# EAGLE design board (EAGLE 9.2.2)
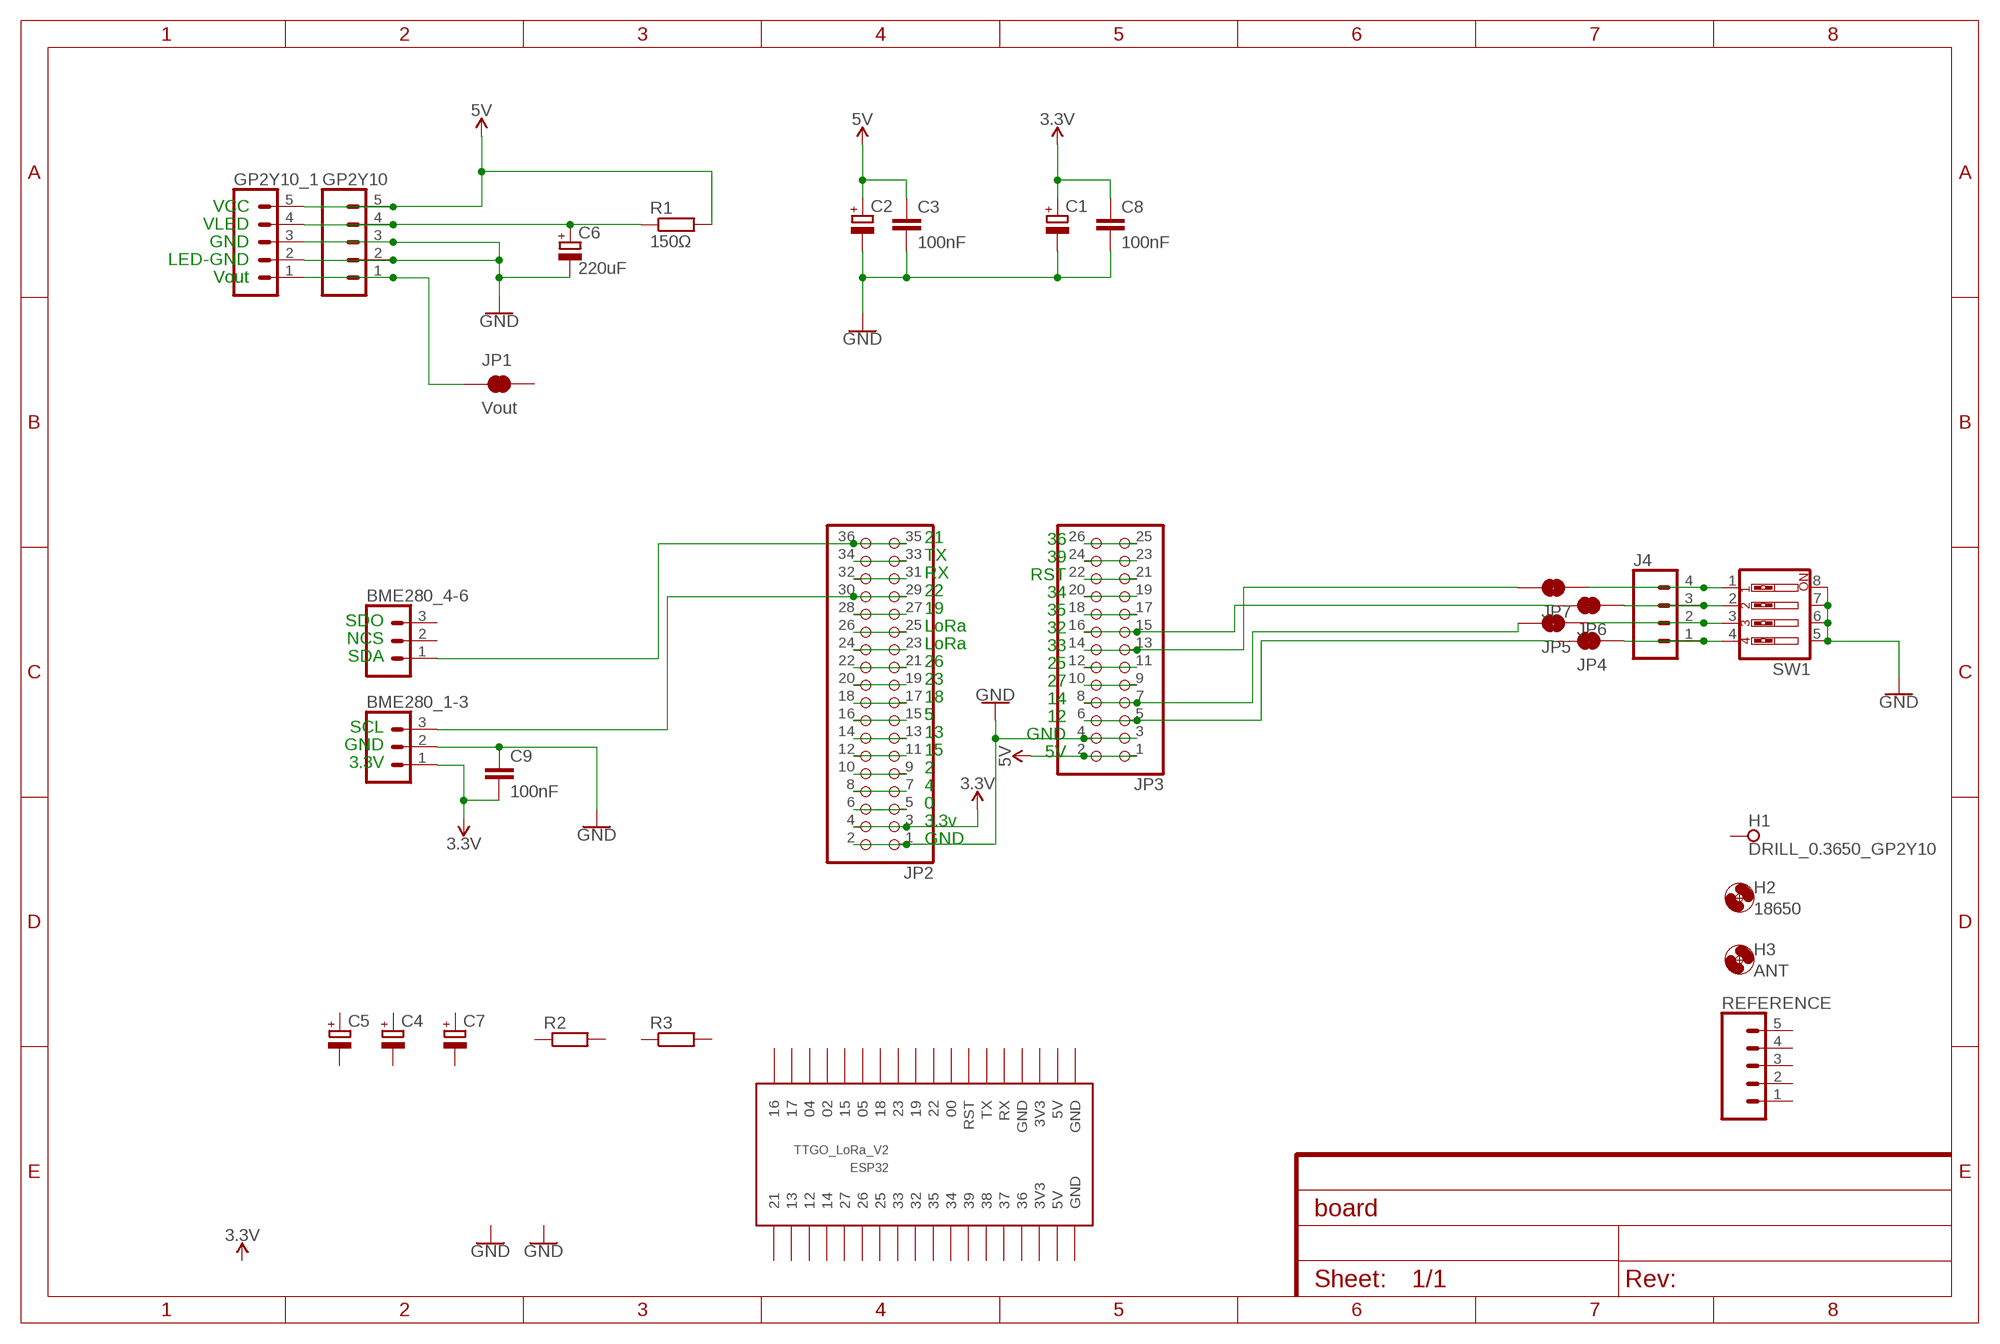
[diagram p0: schematic, sheet 1]

## Parts
BME280_1-3  CONN_03  [1X03]
BME280_4-6  CONN_03  [1X03]
C1  CPOL-EUD  [PANASONIC_D]
C2  CPOL-EUD  [PANASONIC_D]
C3  100nF  C-EUC0805  [C0805]
C4  CPOL-EUD  [PANASONIC_D]
C5  CPOL-EUD  [PANASONIC_D]
C6  220uF  CPOL-EUE2.5-5  [E2,5-5]
C7  CPOL-EUE2.5-5  [E2,5-5]
C8  100nF  C-EUC0805  [C0805]
C9  100nF  C-EUC0805  [C0805]
ESP32  TTGO_LoRa_V2  WIFI-LORA-32  [2.54MM_2X18]
GP2Y10  CONN_05  [1X05]
GP2Y10_1  CONN_05  [1X05]
H1  DRILL_0.3650_GP2Y10  SPECIAL_DRILL_0.3650  [PAD_0.3650]
H2  18650  MOUNT-HOLE2.8  [2,8]
H3  ANT  MOUNT-HOLE3.0  [3,0]
J4  CONN_04LOCK  [1X04_LOCK]
JP1  Vout  JUMPER-SMT_2_NC_TRACE_SILK  [SMT-JUMPER_2_NC_TRACE_SILK]
JP2  PINHD-2X18  [2X18]
JP3  PINHD-2X13  [2X13]
JP4  JUMPER-SMT_2_NC_TRACE_SILK  [SMT-JUMPER_2_NC_TRACE_SILK]
JP5  JUMPER-SMT_2_NC_TRACE_SILK  [SMT-JUMPER_2_NC_TRACE_SILK]
JP6  JUMPER-SMT_2_NC_TRACE_SILK  [SMT-JUMPER_2_NC_TRACE_SILK]
JP7  JUMPER-SMT_2_NC_TRACE_SILK  [SMT-JUMPER_2_NC_TRACE_SILK]
R1  150Ω  R-EU_0204/7  [0204/7]
R2  R-EU_0204/7  [0204/7]
R3  R-EU_0204/7  [0204/7]
REFERENCE  CONN_05  [1X05]
SW1  SW_DIP-4  [EDG-04]

## Nets
3.3V [power]: BME280_1-3.1 C1.+ C8.1 C9.2 JP2.3 JP2.4
5V [power]: C2.+ C3.1 GP2Y10.5 GP2Y10_1.5 JP3.1 JP3.2 R1.2
GND [power]: BME280_1-3.2 C1.- C2.- C3.2 C6.- C8.2 C9.1 GP2Y10.2 GP2Y10.3 GP2Y10_1.2 GP2Y10_1.3 JP2.1 JP2.2 JP3.3 JP3.4 SW1.5 SW1.6 SW1.7 SW1.8
N$1: GP2Y10.1 GP2Y10_1.1 JP1.1
N$2 [power]: C6.+ GP2Y10.4 GP2Y10_1.4 R1.1
N$3: BME280_4-6.1 JP2.35 JP2.36
N$4: JP2.33 JP2.34
N$5: JP2.31 JP2.32
N$6: BME280_1-3.3 JP2.29 JP2.30
N$7: JP2.27 JP2.28
N$8: JP2.25 JP2.26
N$9: JP3.25 JP3.26
N$10: JP3.23 JP3.24
N$11: JP3.21 JP3.22
N$12: JP3.17 JP3.18
N$14: JP3.15 JP3.16 JP6.2
N$15: JP3.13 JP3.14 JP7.2
N$16: JP3.11 JP3.12
N$17: JP3.9 JP3.10
N$18: JP3.7 JP3.8 JP5.2
N$19: JP3.5 JP3.6 JP4.2
N$20: JP3.19 JP3.20
N$24: JP2.5 JP2.6
N$25: JP2.7 JP2.8
N$26: JP2.9 JP2.10
N$27: JP2.11 JP2.12
N$28: JP2.13 JP2.14
N$29: JP2.15 JP2.16
N$30: JP2.17 JP2.18
N$31: JP2.19 JP2.20
N$32: JP2.21 JP2.22
N$33: JP2.23 JP2.24
N$39 [power]: J4.1 JP4.1 SW1.4
N$40 [power]: J4.2 JP5.1 SW1.3
N$41 [power]: J4.3 JP6.1 SW1.2
N$42 [power]: J4.4 JP7.1 SW1.1
Unconnected: BME280_4-6.2 BME280_4-6.3 C4.+ C4.- C5.+ C5.- C7.+ C7.- ESP32.P$1(GND) ESP32.P$2(5V) ESP32.P$3(3V3) ESP32.P$4(GND) ESP32.P$5(RX) ESP32.P$6(TX) ESP32.P$7(RST) ESP32.P$8 ESP32.P$9 ESP32.P$10 ESP32.P$11 ESP32.P$12 ESP32.P$13 ESP32.P$14 ESP32.P$15 ESP32.P$16 ESP32.P$17 ESP32.P$18 ESP32.P$19 ESP32.P$20 ESP32.P$21 ESP32.P$22 ESP32.P$23 ESP32.P$24 ESP32.P$25 ESP32.P$26 ESP32.P$27 ESP32.P$28 ESP32.P$29 ESP32.P$30 ESP32.P$31 ESP32.P$32 ESP32.P$33 ESP32.P$34(3V3) ESP32.P$35(5V) ESP32.P$36(GND) H1.1 JP1.2 R2.1 R2.2 R3.1 R3.2 REFERENCE.1 REFERENCE.2 REFERENCE.3 REFERENCE.4 REFERENCE.5

## Notes on the sheet
- VCC
- VLED
- GND
- LED-GND
- Vout
- 36
- 21
- 39
- TX
- RST
- RX
- 34
- 22
- 35
- SDO | 19
- 32
- NCS | LoRa
- 33
- SDA | LoRa
- 25
- 26
- 27
- 23
- 14
- 18
- 12
- SCL | 5
- GND
- GND | 13
- 5V
- 3.3V | 15
- 2
- 4
- 0
- 3.3v
- GND

## Library data of the parts
BME280_1-3 BME280_4-6 = SparkFun-Connectors:CONN_03: Multi connection point. Often used as Generic Header-pin footprint for 0.1 inch spaced/style header connections On any of the 0.1 inch spaced packages, you can populate with these: Break Away Headers - Straight <https://www.sparkfun.com/products/116> (PRT-00116) Break Away Male Headers - Right Angle <https://www.sparkfun.com/products/553> (PRT-00553) Female Headers <https://www.sparkfun.com/products/115> (PRT-00115) Break Away Headers - Machine Pin <https://www.sparkfun.com/products/117> (PRT-00117) Break Away Female Headers - Swiss Machine Pin <https://www.sparkfun.com/products/743> (PRT-00743) Stackable Header - 3 Pin (Female, 0.1") <https://www.sparkfun.com/products/13875> (PRT-13875) For SCREWTERMINALS and SPRING TERMINALS visit here: Screw Terimnals on SparkFun.com <https://www.sparkfun.com/search/results?term=Screw+Terminals> (5mm/3.5mm/2.54mm spacing) This device is also useful as a general connection point to wire up your design to another part of your project. Our various solder wires solder well into these plated through hole pads. Hook-Up Wire - Assortment (Stranded, 22 AWG) <https://www.sparkfun.com/products/11375> (PRT-11375) Hook-Up Wire - Assortment (Solid Core, 22 AWG) <https://www.sparkfun.com/products/11367> (PRT-11367) View the entire wire category on our website here <https://www.sparkfun.com/categories/141> Special notes: Molex polarized connector foot print use with SKU : PRT-08232 with associated crimp pins and housings.
C1 C2 C4-C7 = rcl:CPOL-EU: POLARIZED CAPACITOR, European symbol; SPICEPREFIX: C
C3 C8 C9 = rcl:C-EU: CAPACITOR, European symbol; SPICEPREFIX: C
ESP32 = ESP32_modules:WIFI-LORA-32
GP2Y10 GP2Y10_1 REFERENCE = SparkFun-Connectors:CONN_05: Multi connection point. Often used as Generic Header-pin footprint for 0.1 inch spaced/style header connections On any of the 0.1 inch spaced packages, you can populate with these: Break Away Headers - Straight <https://www.sparkfun.com/products/116> (PRT-00116) Break Away Male Headers - Right Angle <https://www.sparkfun.com/products/553> (PRT-00553) Female Headers <https://www.sparkfun.com/products/115> (PRT-00115) Break Away Headers - Machine Pin <https://www.sparkfun.com/products/117> (PRT-00117) Break Away Female Headers - Swiss Machine Pin <https://www.sparkfun.com/products/743> (PRT-00743) For SCREWTERMINALS and SPRING TERMINALS visit here: Screw Terimnals on SparkFun.com <https://www.sparkfun.com/search/results?term=Screw+Terminals> (5mm/3.5mm/2.54mm spacing) This device is also useful as a general connection point to wire up your design to another part of your project. Our various solder wires solder well into these plated through hole pads. Hook-Up Wire - Assortment (Stranded, 22 AWG) <https://www.sparkfun.com/products/11375> (PRT-11375) Hook-Up Wire - Assortment (Solid Core, 22 AWG) <https://www.sparkfun.com/products/11367> (PRT-11367) View the entire wire category on our website here <https://www.sparkfun.com/categories/141> Special notes: Molex polarized connector foot print use with SKU : PRT-08231 with associated crimp pins and housings. 1MM SMD Version SKU: PRT-10208
H1 = special-drill:SPECIAL_DRILL_: Special drills
H2 H3 = holes:MOUNT-HOLE: MOUNTING HOLE with drill center marker
J4 = SparkFun-Connectors:CONN_04: Multi connection point. Often used as Generic Header-pin footprint for 0.1 inch spaced/style header connections On any of the 0.1 inch spaced packages, you can populate with these: Break Away Headers - Straight <https://www.sparkfun.com/products/116> (PRT-00116) Break Away Male Headers - Right Angle <https://www.sparkfun.com/products/553> (PRT-00553) Female Headers <https://www.sparkfun.com/products/115> (PRT-00115) Break Away Headers - Machine Pin <https://www.sparkfun.com/products/117> (PRT-00117) Break Away Female Headers - Swiss Machine Pin <https://www.sparkfun.com/products/743> (PRT-00743) For SCREWTERMINALS and SPRING TERMINALS visit here: Screw Terimnals on SparkFun.com <https://www.sparkfun.com/search/results?term=Screw+Terminals> (5mm/3.5mm/2.54mm spacing) This device is also useful as a general connection point to wire up your design to another part of your project. Our various solder wires solder well into these plated through hole pads. Hook-Up Wire - Assortment (Stranded, 22 AWG) <https://www.sparkfun.com/products/11375> (PRT-11375) Hook-Up Wire - Assortment (Solid Core, 22 AWG) <https://www.sparkfun.com/products/11367> (PRT-11367) View the entire wire category on our website here <https://www.sparkfun.com/categories/141> Special notes: Molex polarized connector foot print use with SKU : PRT-08231 with associated crimp pins and housings. 1MM SMD Version SKU: PRT-10208; PROD_ID: CONN-09696
JP1 JP4-JP7 = SparkFun-Jumpers:JUMPER-SMT_2_NC_TRACE: Normally closed trace jumper This jumper has a trace between two pads so it's normally closed (NC). Use a razor knife to open the connection. For best results follow the IPC guidelines for cutting traces: Cutout at least 0.063 mm (0.005 in). Remove all loose material to clean up the cut area. Seal the cut with an approved epoxy. Reapply solder to reclose the connection.
JP2 = pinhead:PINHD-2X18: PIN HEADER
JP3 = pinhead:PINHD-2X13: PIN HEADER
R1-R3 = rcl:R-EU_: RESISTOR, European symbol; SPICEPREFIX: R
SW1 = special:SW_DIP-4: DIP SWITCH

## Net classes
0 default: width 0.254 mm, clearance 0.205 mm
1 power: width 0.914 mm, clearance 0.254 mm

## Board
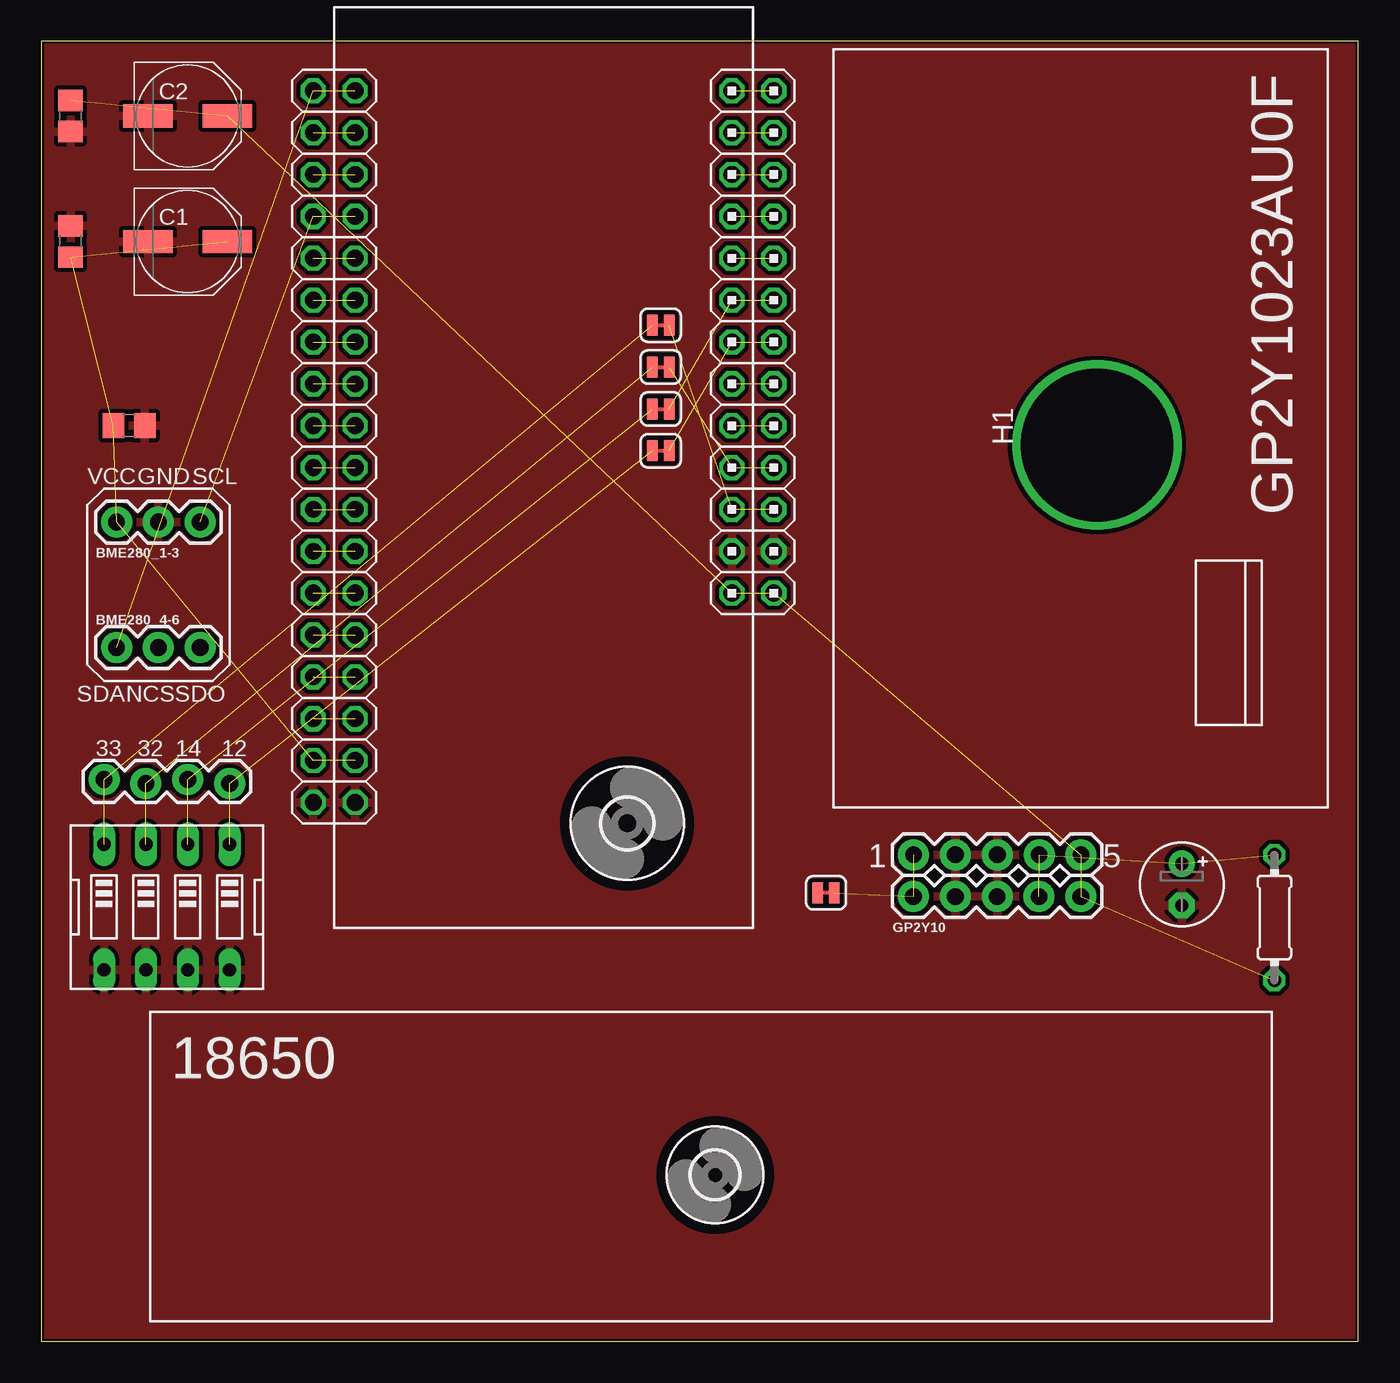
[diagram p1: board, top side]
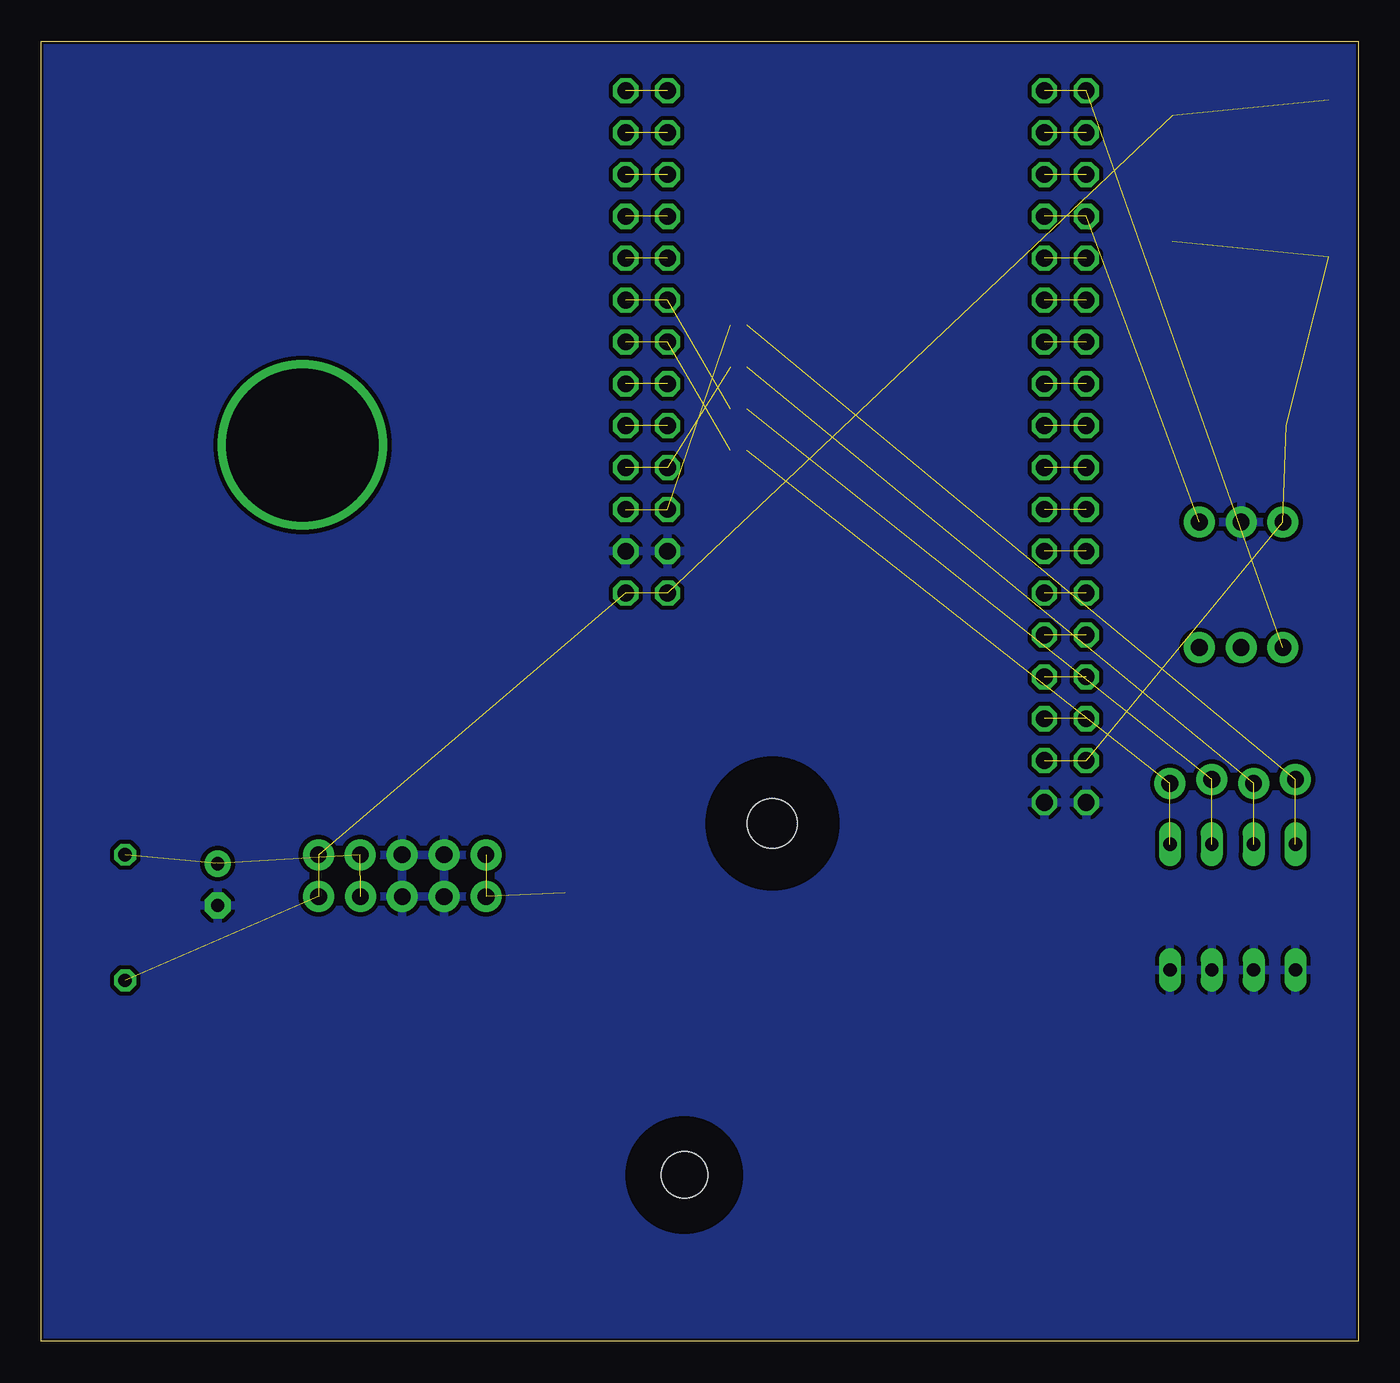
[diagram p2: board, bottom side, seen from below]

Size 79.92 x 78.89 mm. Coordinates in mm from the lower left corner, seen from the top.
Outline: 0,0 79.92,0 79.92,78.89 0,78.89 0,0
Copper layers (1*16): Top 0.035mm / dielectric 1.5mm / Bottom 0.035mm
Design rules "default *": minimum track width 6mil, minimum drill 0.35mm, track to track 6mil, track to pad 6mil, pad to pad 6mil, via to via 6mil, smd to smd 6mil, copper to edge 6mil, drill to drill 6mil, minimum pad ring 10mil, minimum via ring 8mil, stop-mask expansion 4mil, vias tented up to drill 0mil, thermal gap 10mil

### Footprints (pad centres in the part's own frame; a part is rotated, then mirrored left to right if it is on the bottom)
1X03 = drill 1.016 pad 1.88: 1 0,0; 2 2.54,0; 3 5.08,0
PANASONIC_D = smd 3 x 1.4: + 2.4,0; - -2.4,0
C0805 = smd 1.3 x 1.5: 1 -0.95,0; 2 0.95,0
E2,5-5 = drill 0.813 pad 1.6: + -1.27,0 | drill 0.813 pad 1.6 octagon: - 1.27,0
2.54MM_2X18 = drill 0.8 square: P$1 -20.32,-11.43; P$36 -20.32,11.43 | drill 0.8 octagon: P$2 -17.78,-11.43; P$3 -15.24,-11.43; P$4 -12.7,-11.43; P$5 -10.16,-11.43; P$6 -7.62,-11.43; P$7 -5.08,-11.43; P$8 -2.54,-11.43; P$9 0,-11.43; P$10 2.54,-11.43; P$11 5.08,-11.43; P$12 7.62,-11.43; P$13 10.16,-11.43; P$14 12.7,-11.43; P$15 15.24,-11.43; P$16 17.78,-11.43; P$17 20.32,-11.43; P$18 22.86,-11.43; P$19 22.86,11.43; P$20 20.32,11.43; P$21 17.78,11.43; P$22 15.24,11.43; P$23 12.7,11.43; P$24 10.16,11.43; P$25 7.62,11.43; P$26 5.08,11.43; P$27 2.54,11.43; P$28 0,11.43; P$29 -2.54,11.43; P$30 -5.08,11.43; P$31 -7.62,11.43; P$32 -10.16,11.43; P$33 -12.7,11.43; P$34 -15.24,11.43; P$35 -17.78,11.43
1X05 = drill 1.016 pad 1.88: 1 0,0; 2 2.54,0; 3 5.08,0; 4 7.62,0; 5 10.16,0
PAD_0.3650 = drill 9.271 pad 9.271: 1 0,0
2,8 = hole 2.8: 0,0
3,0 = hole 3: 0,0
1X04_LOCK = drill 1.016 pad 1.88: 1 0,0.127; 2 2.54,-0.127; 3 5.08,0.127; 4 7.62,-0.127
SMT-JUMPER_2_NC_TRACE_SILK = smd 0.635 x 1.27: 1 -0.508,0; 2 0.508,0
2X18 = drill 1.016 octagon: 1 -21.59,-1.27; 2 -21.59,1.27; 3 -19.05,-1.27; 4 -19.05,1.27; 5 -16.51,-1.27; 6 -16.51,1.27; 7 -13.97,-1.27; 8 -13.97,1.27; 9 -11.43,-1.27; 10 -11.43,1.27; 11 -8.89,-1.27; 12 -8.89,1.27; 13 -6.35,-1.27; 14 -6.35,1.27; 15 -3.81,-1.27; 16 -3.81,1.27; 17 -1.27,-1.27; 18 -1.27,1.27; 19 1.27,-1.27; 20 1.27,1.27; 21 3.81,-1.27; 22 3.81,1.27; 23 6.35,-1.27; 24 6.35,1.27; 25 8.89,-1.27; 26 8.89,1.27; 27 11.43,-1.27; 28 11.43,1.27; 29 13.97,-1.27; 30 13.97,1.27; 31 16.51,-1.27; 32 16.51,1.27; 33 19.05,-1.27; 34 19.05,1.27; 35 21.59,-1.27; 36 21.59,1.27
2X13 = drill 1.016 octagon: 1 -15.24,-1.27; 2 -15.24,1.27; 3 -12.7,-1.27; 4 -12.7,1.27; 5 -10.16,-1.27; 6 -10.16,1.27; 7 -7.62,-1.27; 8 -7.62,1.27; 9 -5.08,-1.27; 10 -5.08,1.27; 11 -2.54,-1.27; 12 -2.54,1.27; 13 0,-1.27; 14 0,1.27; 15 2.54,-1.27; 16 2.54,1.27; 17 5.08,-1.27; 18 5.08,1.27; 19 7.62,-1.27; 20 7.62,1.27; 21 10.16,-1.27; 22 10.16,1.27; 23 12.7,-1.27; 24 12.7,1.27; 25 15.24,-1.27; 26 15.24,1.27
0204/7 = drill 0.813 octagon: 1 -3.81,0; 2 3.81,0
EDG-04 = drill 0.813 long: 1 -3.81,-3.81; 2 -1.27,-3.81; 3 1.27,-3.81; 4 3.81,-3.81; 5 3.81,3.81; 6 1.27,3.81; 7 -1.27,3.81; 8 -3.81,3.81

### Placement (x,y rotation side)
BME280_1-3  4.57,49.72 0 top
BME280_4-6  4.57,42.1 0 top
C1  8.89,66.74 0 top
C2  8.89,74.36 0 top
C3  1.78,74.36 270 top
C4  -15.24,74.61 0 top  (outside the outline)
C5  -15.24,66.99 0 top  (outside the outline)
C6  69.21,27.72 270 top
C7  -15.24,51.75 0 top  (outside the outline)
C8  1.78,66.74 90 top
C9  5.33,55.56 180 top
ESP32  43.18,97.47 0 top  (outside the outline)
GP2Y10  52.93,26.99 0 top
GP2Y10_1  52.93,29.53 0 top
H1  64.07,54.39 90 top
H2  40.89,10.09 0 top
H3  35.56,31.43 0 top
J4  3.81,33.97 0 top
JP1  47.62,27.21 180 top
JP2  17.78,54.29 90 top
JP3  43.18,60.64 90 top
JP4  37.59,61.66 0 top
JP5  37.59,59.12 0 top
JP6  37.59,56.58 0 top
JP7  37.59,54.04 0 top
R1  74.83,25.71 270 top
R2  -15.24,39.05 0 top  (outside the outline)
R3  -15.24,33.97 0 top  (outside the outline)
REFERENCE  5.1,90.95 90 top  (outside the outline)
SW1  7.62,26.35 180 top

### Tracks (layer width: path | path; a pad name or v marks a point on that pad's centre or on a via)
3.3V  (5 unrouted)
5V  (6 unrouted)
GND
  pour Bottom: -129.54,155.89 -129.54,-72.71 200.66,-72.71 200.66,155.89
  pour Top: -129.54,155.89 -129.54,-72.71 200.66,-72.71 200.66,155.89
N$1  (2 unrouted)
N$2  (3 unrouted)
N$3  (2 unrouted)
N$4  (1 unrouted)
N$5  (1 unrouted)
N$6  (2 unrouted)
N$7  (1 unrouted)
N$8  (1 unrouted)
N$9  (1 unrouted)
N$10  (1 unrouted)
N$11  (1 unrouted)
N$12  (1 unrouted)
N$14  (2 unrouted)
N$15  (2 unrouted)
N$16  (1 unrouted)
N$17  (1 unrouted)
N$18  (2 unrouted)
N$19  (2 unrouted)
N$20  (1 unrouted)
N$24  (1 unrouted)
N$25  (1 unrouted)
N$26  (1 unrouted)
N$27  (1 unrouted)
N$28  (1 unrouted)
N$29  (1 unrouted)
N$30  (1 unrouted)
N$31  (1 unrouted)
N$32  (1 unrouted)
N$33  (1 unrouted)
N$39  (2 unrouted)
N$40  (2 unrouted)
N$41  (2 unrouted)
N$42  (2 unrouted)

### Text on the board
tPlace: GP2Y1023AU0F | VCC | GND | SCL | SDA | NCS | SDO | 33 | 32 | 14 | 12 | 1 | 5 | 18650